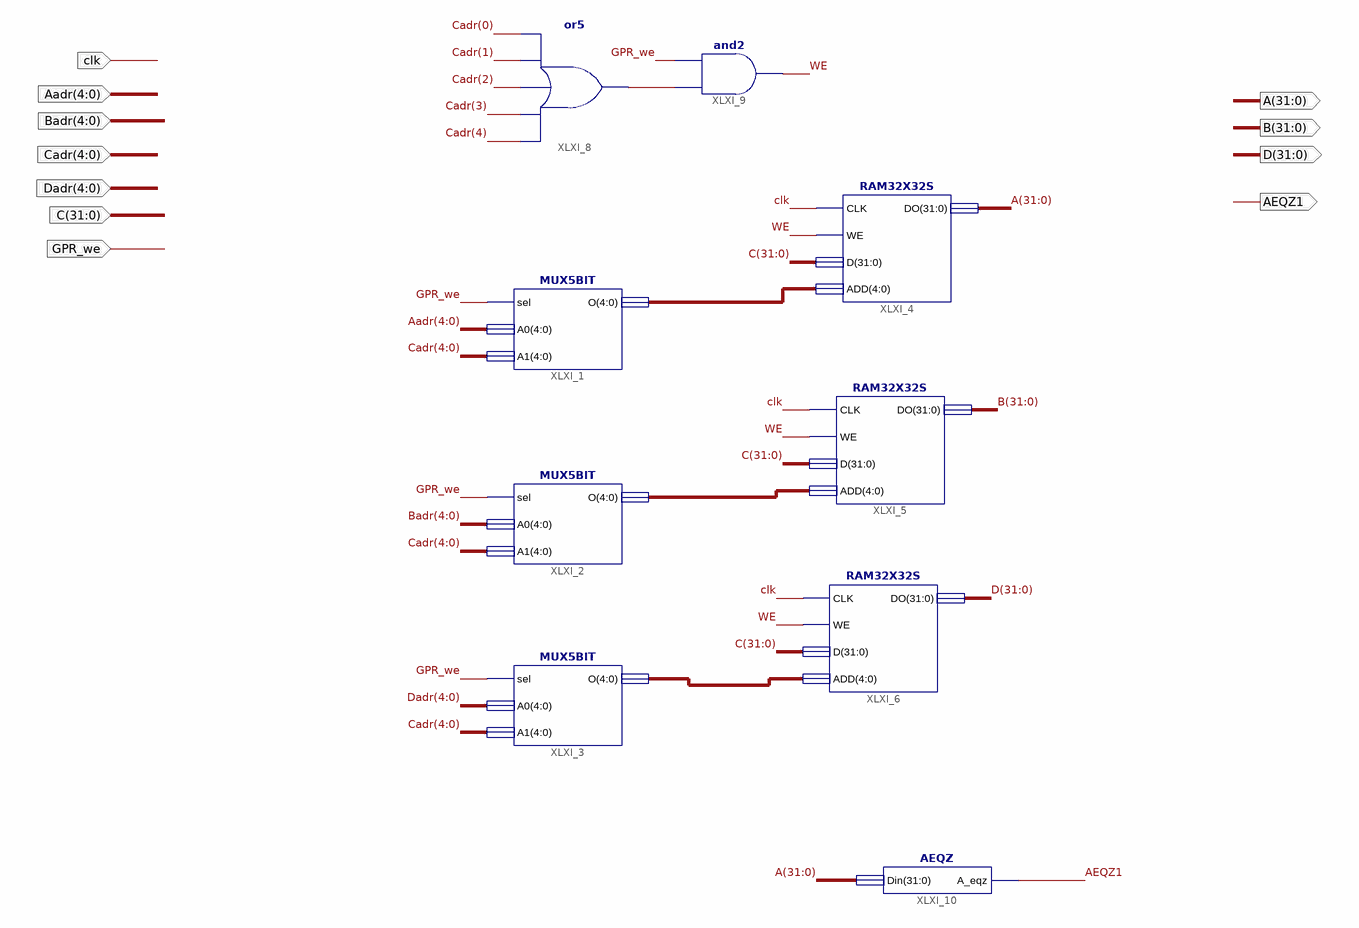
[diagram p0: schematic sheet 1]
// Xilinx ISE schematic GPR_environment.sch (spartan6) as structural Verilog: 9 symbols, 11 ports
module GPR_environment (
  input  clk,
  input  [4:0] Aadr,
  input  [4:0] Badr,
  input  [4:0] Cadr,
  input  [4:0] Dadr,
  input  [31:0] C,
  input  GPR_we,
  output [31:0] A,
  output [31:0] B,
  output [31:0] D,
  output AEQZ1
);

  wire WE, XLXN_17;
  wire [4:0] XLXN_28, XLXN_33, XLXN_37;

  MUX5BIT XLXI_1 (.sel(GPR_we), .A0(Aadr), .A1(Cadr), .O(XLXN_28));
  MUX5BIT XLXI_2 (.sel(GPR_we), .A0(Badr), .A1(Cadr), .O(XLXN_33));
  MUX5BIT XLXI_3 (.sel(GPR_we), .A0(Dadr), .A1(Cadr), .O(XLXN_37));
  RAM32X32S XLXI_4 (.CLK(clk), .WE(WE), .D(C), .ADD(XLXN_28), .DO(A));
  RAM32X32S XLXI_5 (.CLK(clk), .WE(WE), .D(C), .ADD(XLXN_33), .DO(B));
  RAM32X32S XLXI_6 (.CLK(clk), .WE(WE), .D(C), .ADD(XLXN_37), .DO(D));
  or XLXI_8 (XLXN_17, Cadr[4], Cadr[3], Cadr[2], Cadr[1], Cadr[0]);
  and XLXI_9 (WE, XLXN_17, GPR_we);
  AEQZ XLXI_10 (.Din(A), .A_eqz(AEQZ1));
endmodule
